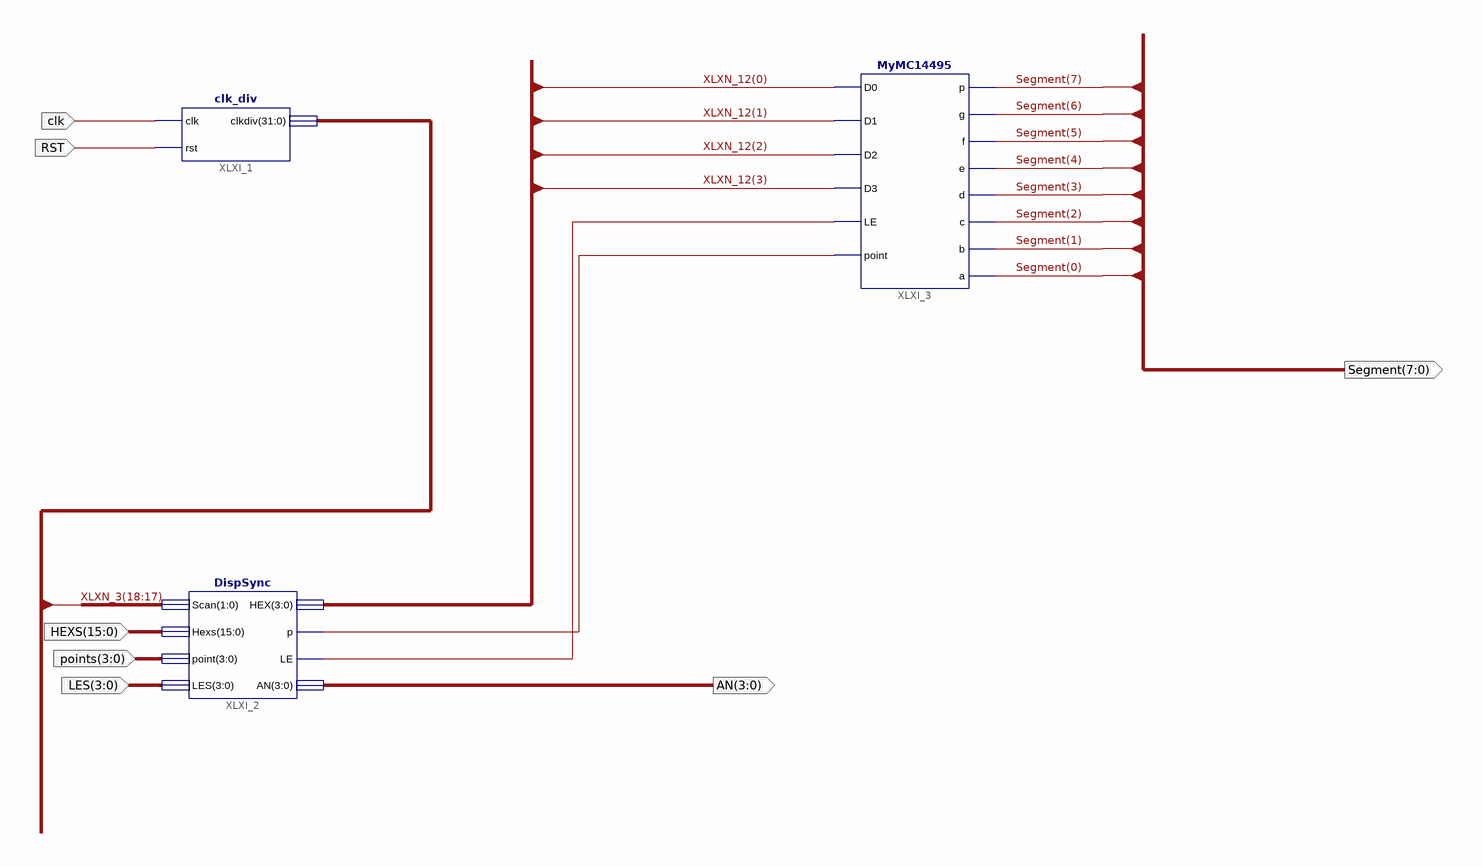
[diagram p0: schematic sheet 1]
// Xilinx ISE schematic DispNum.sch (kintex7) as structural Verilog: 3 symbols, 7 ports
module DispNum (
  input  clk,
  input  RST,
  input  [15:0] HEXS,
  input  [3:0] points,
  input  [3:0] LES,
  output [3:0] AN,
  output [7:0] Segment
);

  wire XLXN_10, XLXN_11;
  wire [3:0] XLXN_12;
  wire [31:0] XLXN_3;

  clk_div XLXI_1 (.clk(clk), .rst(RST), .clkdiv(XLXN_3));
  DispSync XLXI_2 (
    .Scan(XLXN_3[18:17]), .Hexs(HEXS), .point(points), .LES(LES), .HEX(XLXN_12), .p(XLXN_10), .LE(XLXN_11),
    .AN(AN));
  MyMC14495 XLXI_3 (
    .point(XLXN_10), .LE(XLXN_11), .D3(XLXN_12[3]), .D2(XLXN_12[2]), .D1(XLXN_12[1]), .D0(XLXN_12[0]),
    .p(Segment[7]), .g(Segment[6]), .f(Segment[5]), .e(Segment[4]), .d(Segment[3]), .c(Segment[2]),
    .b(Segment[1]), .a(Segment[0]));
endmodule
